# EAGLE design TheLittleEngineers.org-27C512E-TO-2532S-V1R1.20.APRIL.2019 (EAGLE 5.10)
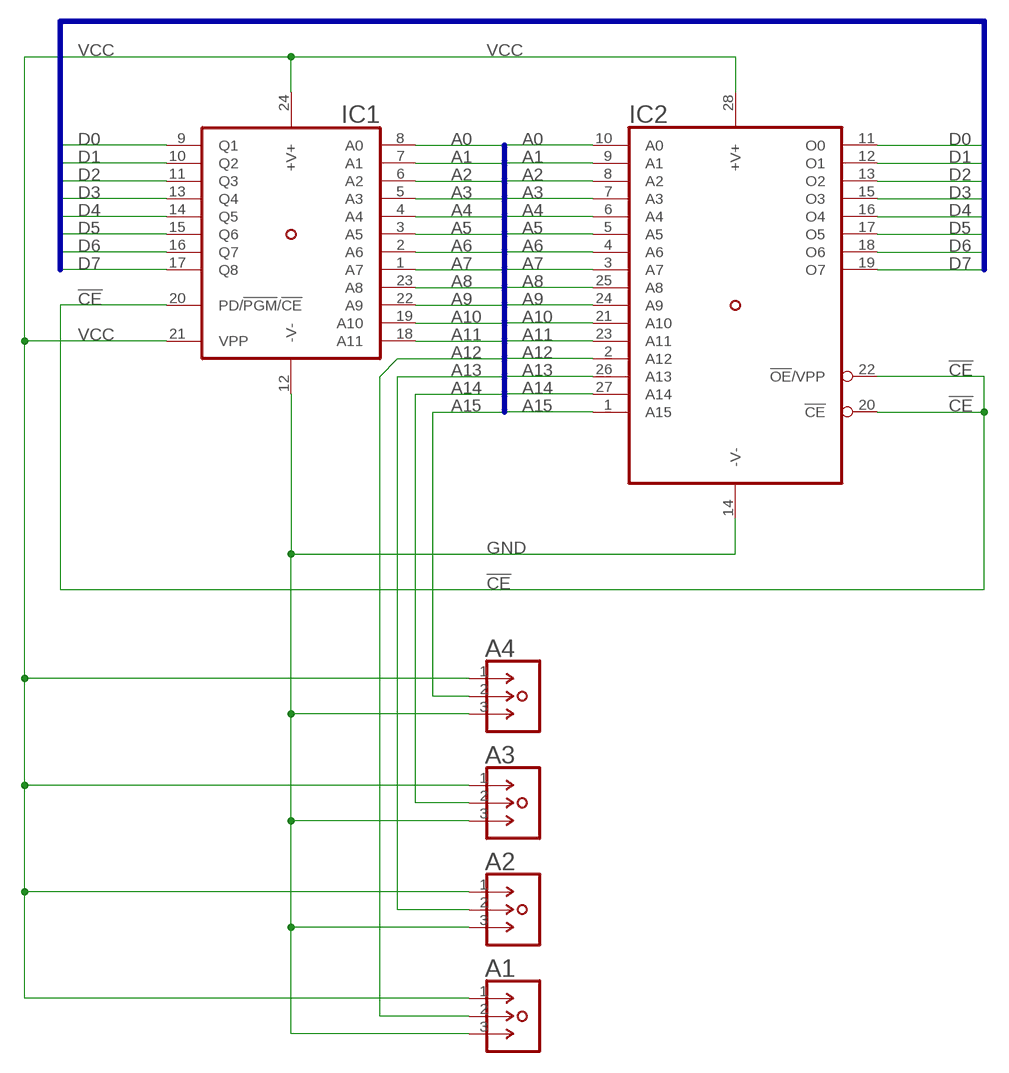
[diagram p0: schematic, sheet 1]

## Parts
A1  1X03-STAGGERED-S  [1X03-STAGGERED]
A2  1X03-STAGGERED-S  [1X03-STAGGERED]
A3  1X03-STAGGERED-S  [1X03-STAGGERED]
A4  1X03-STAGGERED-S  [1X03-STAGGERED]
IC1  TMS2532-NO  [DIL24-6-NO-OUTLINE]
IC2  27C512D-NO  [DIL28-6-NO-OUTLINE]

## Nets
!CE: IC1.20(PD/!PGM!/!CE) IC2.20(!CE) IC2.22(!OE!/VPP)
A0: IC1.8(A0) IC2.10(A0)
A1: IC1.7(A1) IC2.9(A1)
A2: IC1.6(A2) IC2.8(A2)
A3: IC1.5(A3) IC2.7(A3)
A4: IC1.4(A4) IC2.6(A4)
A5: IC1.3(A5) IC2.5(A5)
A6: IC1.2(A6) IC2.4(A6)
A7: IC1.1(A7) IC2.3(A7)
A8: IC1.23(A8) IC2.25(A8)
A9: IC1.22(A9) IC2.24(A9)
A10: IC1.19(A10) IC2.21(A10)
A11: IC1.18(A11) IC2.23(A11)
A12: A1.2 IC2.2(A12)
A13: A2.2 IC2.26(A13)
A14: A3.2 IC2.27(A14)
A15: A4.2 IC2.1(A15)
D0: IC1.9(Q1) IC2.11(O0)
D1: IC1.10(Q2) IC2.12(O1)
D2: IC1.11(Q3) IC2.13(O2)
D3: IC1.13(Q4) IC2.15(O3)
D4: IC1.14(Q5) IC2.16(O4)
D5: IC1.15(Q6) IC2.17(O5)
D6: IC1.16(Q7) IC2.18(O6)
D7: IC1.17(Q8) IC2.19(O7)
GND [power]: A1.3 A2.3 A3.3 A4.3 IC1.12(-V-) IC2.14(-V-)
VCC [power]: A1.1 A2.1 A3.1 A4.1 IC1.21(VPP) IC1.24(+V+) IC2.28(+V+)

## Buses
D[0..7]
A[0..15]

## Library data of the parts
A1-A4 = TheLittleEngineers.org-27C512E-TO-2532S-V1R0.20.APRIL.2019:1X03-STAGGERED: 3-Pin SIP Header Copyright ©07 Jan 2013, by: Robert "The R.A.T." Allen Turner http://www.TheLittleEngineers.org/ TheLittleEngineers@outlook.com OurLittleEngineers@gMail.com You may use these components in your own projects, however, please take note that we CANNOT guarantee the accuracy of these components (nor any part of this library). We make NO guarantees that the components, footprints or schematic symbols in this library are flawless, and we make no promises of fitness for production, prototyping or any other purpose. These libraries are provided for informational purposes only, and are used at your own discretion. By downloading these libraries, you agree that we cannot be held responsible for faulty PCBs. You should always check the footprints with a 1:1 printout. Neither Robert Allen Turner, The Little Engineers <http://www.TheLittleEngineers.org/>, TheLittleEngineers.org, GIMEchip.com, nor anyone affiliated with same shall be held responsible for any outcome resulting from the usage of these files. Should any errors be found, please contact us at one of the above email addresses and we will attempt to repair them. Unless otherwise noted, content of this library is licensed under a Creative Commons Attribution-ShareAlike 4.0 International (CC BY-SA 4.0) license (https://creativecommons.org/licenses/by-sa/4.0/) on 20 April 2019 in memory of my Father, Robert Embry Turner - I LOVE YOU DAD! Rest In Peace. Please note that the GIMEchip.com domain was acquired by Robert "The R.A.T." Allen Turner on December 24, 2018 from the prior owners, which happen to be his brother and nephew. As such, "The R.A.T." is unable to answer any inquiries regarding any products or services of GIMEchip.com prior to that date. "The R.A.T." also acquired the rights to all products previously produced by GIMEchip.com and its previous owners. Those products will all be released as open source, under a Creative Commons Attribution-ShareAlike 4.0 International (CC BY-SA 4.0) license (https://creativecommons.org/licenses/by-sa/4.0/), as time and resources permit.
IC1 = TheLittleEngineers.org-27C512E-TO-2532S-V1R0.20.APRIL.2019:TMS2532: TMS2532 Copyright ©07 Jan 2013, by: Robert "The R.A.T." Allen Turner http://www.TheLittleEngineers.org/ TheLittleEngineers@outlook.com OurLittleEngineers@gMail.com You may use these components in your own projects, however, please take note that we CANNOT guarantee the accuracy of these components (nor any part of this library). We make NO guarantees that the components, footprints or schematic symbols in this library are flawless, and we make no promises of fitness for production, prototyping or any other purpose. These libraries are provided for informational purposes only, and are used at your own discretion. By downloading these libraries, you agree that we cannot be held responsible for faulty PCBs. You should always check the footprints with a 1:1 printout. Neither Robert Allen Turner, The Little Engineers <http://www.TheLittleEngineers.org/>, TheLittleEngineers.org, GIMEchip.com, nor anyone affiliated with same shall be held responsible for any outcome resulting from the usage of these files. Should any errors be found, please contact us at one of the above email addresses and we will attempt to repair them. Unless otherwise noted, content of this library is licensed under a Creative Commons Attribution-ShareAlike 4.0 International (CC BY-SA 4.0) license (https://creativecommons.org/licenses/by-sa/4.0/) on 20 April 2019 in memory of my Father, Robert Embry Turner - I LOVE YOU DAD! Rest In Peace. Please note that the GIMEchip.com domain was acquired by Robert "The R.A.T." Allen Turner on December 24, 2018 from the prior owners, which happen to be his brother and nephew. As such, "The R.A.T." is unable to answer any inquiries regarding any products or services of GIMEchip.com prior to that date. "The R.A.T." also acquired the rights to all products previously produced by GIMEchip.com and its previous owners. Those products will all be released as open source, under a Creative Commons Attribution-ShareAlike 4.0 International (CC BY-SA 4.0) license (https://creativecommons.org/licenses/by-sa/4.0/), as time and resources permit.
IC2 = TheLittleEngineers.org-27C512E-TO-2532S-V1R0.20.APRIL.2019:27C512D: 27C512D Copyright ©07 Jan 2013, by: Robert "The R.A.T." Allen Turner http://www.TheLittleEngineers.org/ TheLittleEngineers@outlook.com OurLittleEngineers@gMail.com You may use these components in your own projects, however, please take note that we CANNOT guarantee the accuracy of these components (nor any part of this library). We make NO guarantees that the components, footprints or schematic symbols in this library are flawless, and we make no promises of fitness for production, prototyping or any other purpose. These libraries are provided for informational purposes only, and are used at your own discretion. By downloading these libraries, you agree that we cannot be held responsible for faulty PCBs. You should always check the footprints with a 1:1 printout. Neither Robert Allen Turner, The Little Engineers <http://www.TheLittleEngineers.org/>, TheLittleEngineers.org, GIMEchip.com, nor anyone affiliated with same shall be held responsible for any outcome resulting from the usage of these files. Should any errors be found, please contact us at one of the above email addresses and we will attempt to repair them. Unless otherwise noted, content of this library is licensed under a Creative Commons Attribution-ShareAlike 4.0 International (CC BY-SA 4.0) license (https://creativecommons.org/licenses/by-sa/4.0/) on 20 April 2019 in memory of my Father, Robert Embry Turner - I LOVE YOU DAD! Rest In Peace. Please note that the GIMEchip.com domain was acquired by Robert "The R.A.T." Allen Turner on December 24, 2018 from the prior owners, which happen to be his brother and nephew. As such, "The R.A.T." is unable to answer any inquiries regarding any products or services of GIMEchip.com prior to that date. "The R.A.T." also acquired the rights to all products previously produced by GIMEchip.com and its previous owners. Those products will all be released as open source, under a Creative Commons Attribution-ShareAlike 4.0 International (CC BY-SA 4.0) license (https://creativecommons.org/licenses/by-sa/4.0/), as time and resources permit.

## Net classes
0 default: width 0.203 mm, clearance 0.203 mm
1 power: width 0.381 mm, clearance 0.203 mm

## Board
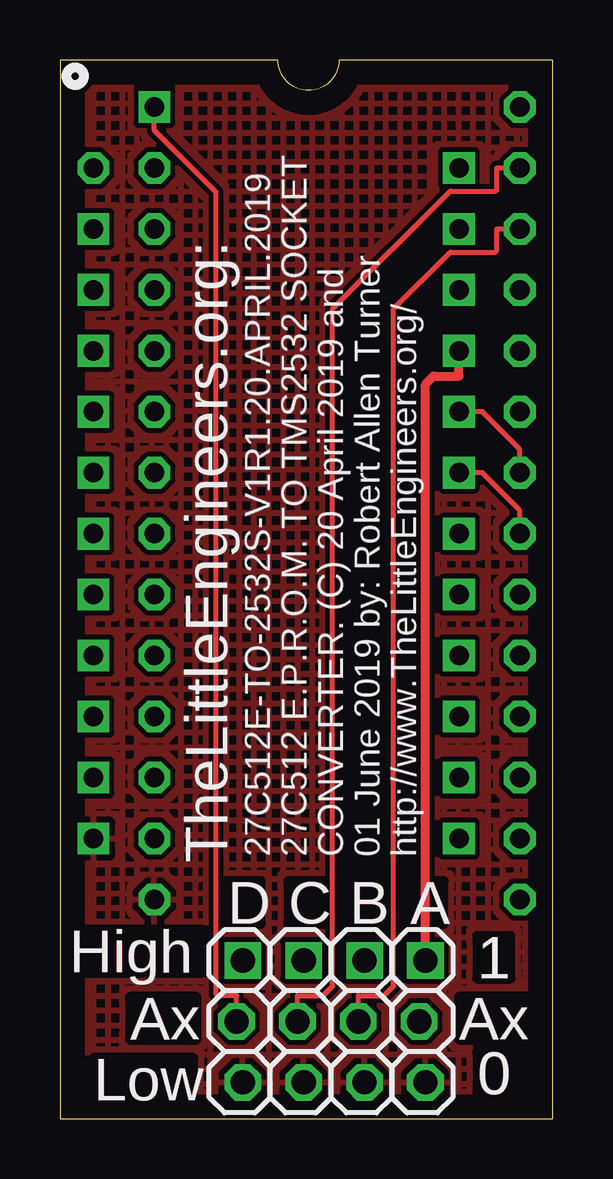
[diagram p1: board, top side]
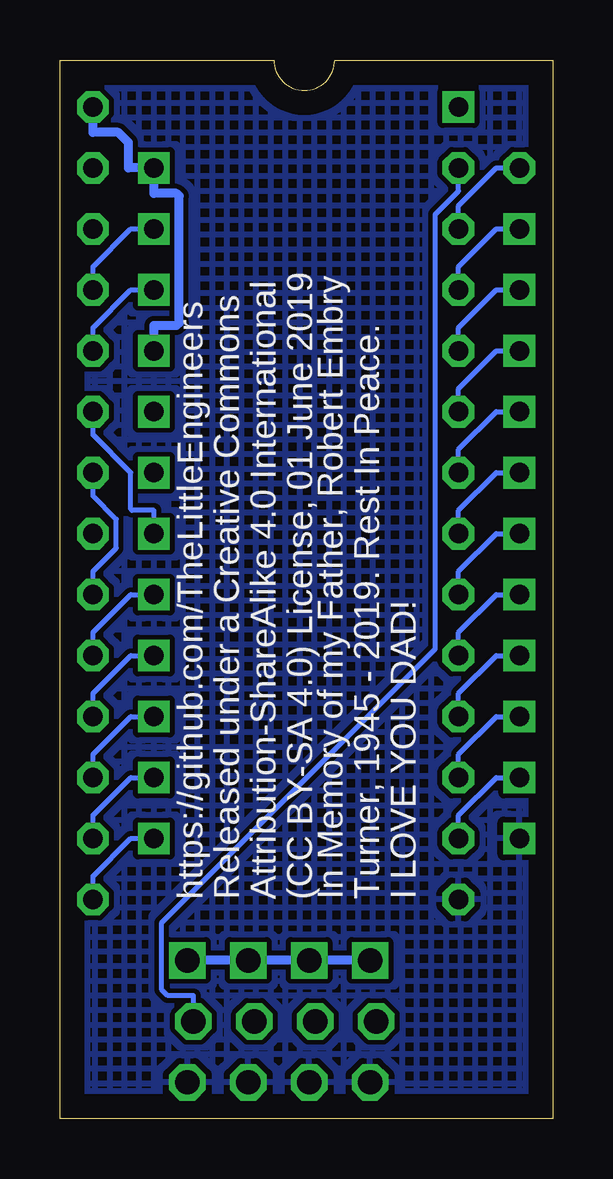
[diagram p2: board, bottom side, seen from below]

Size 20.55 x 44.12 mm. Coordinates in mm from the lower left corner, seen from the top.
Copper layers (1*16): Top 0.035mm / dielectric 1.5mm / Bottom 0.035mm
Design rules "default": minimum track width 10mil, minimum drill 24mil, track to track 8mil, track to pad 8mil, pad to pad 8mil, via to via 8mil, smd to smd 8mil, copper to edge 40mil, drill to drill 8mil, minimum pad ring 10mil, minimum via ring 8mil, stop-mask expansion 4mil, vias tented up to drill 0mil, thermal gap 10mil

### Footprints (pad centres in the part's own frame; a part is rotated, then mirrored left to right if it is on the bottom)
1X03-STAGGERED = drill 1.016 square: 1 -2.54,0.127 | drill 1.016 octagon: 2 0,-0.127; 3 2.54,0.127
DIL24-6-NO-OUTLINE = drill 0.813 octagon: 1 -13.97,-7.62 | drill 0.813 square: 2 -11.43,-7.62; 3 -8.89,-7.62; 4 -6.35,-7.62; 5 -3.81,-7.62; 6 -1.27,-7.62; 7 1.27,-7.62; 8 3.81,-7.62; 9 6.35,-7.62; 10 8.89,-7.62; 11 11.43,-7.62; 12 13.97,-7.62; 13 13.97,7.62; 14 11.43,7.62; 15 8.89,7.62; 16 6.35,7.62; 17 3.81,7.62; 18 1.27,7.62; 19 -1.27,7.62; 20 -3.81,7.62; 21 -6.35,7.62; 22 -8.89,7.62; 23 -11.43,7.62; 24 -13.97,7.62
DIL28-6-NO-OUTLINE = drill 0.813 square: 1 -16.51,-7.62 | drill 0.813 octagon: 2 -13.97,-7.62; 3 -11.43,-7.62; 4 -8.89,-7.62; 5 -6.35,-7.62; 6 -3.81,-7.62; 7 -1.27,-7.62; 8 1.27,-7.62; 9 3.81,-7.62; 10 6.35,-7.62; 11 8.89,-7.62; 12 11.43,-7.62; 13 13.97,-7.62; 14 16.51,-7.62; 15 16.51,7.62; 16 13.97,7.62; 17 11.43,7.62; 18 8.89,7.62; 19 6.35,7.62; 20 3.81,7.62; 21 1.27,7.62; 22 -1.27,7.62; 23 -3.81,7.62; 24 -6.35,7.62; 25 -8.89,7.62; 26 -11.43,7.62; 27 -13.97,7.62; 28 -16.51,7.62

### Placement (x,y rotation side)
A1  15.11,4.06 270 top
A2  12.57,4.06 270 top
A3  10.03,4.06 270 top
A4  7.49,4.06 270 top
IC1  9.02,25.65 270 top
IC2  11.56,25.65 270 top
U$1  [OUTLINE]  1.4,0.25 0 top

### Tracks (layer width: path | path; a pad name or v marks a point on that pad's centre or on a via)
!CE
  Top 0.203: IC1.20 17.6,29.46 19.18,27.89 IC2.22
  Bottom 0.203: IC2.22 19.18,25.96 18.21,24.99 18.21,23.78 19.18,22.81 IC2.20
A0
  Bottom 0.203: IC1.8 2.37,21.84 3.94,20.27 IC2.10
A1
  Bottom 0.203: IC1.7 2.37,24.38 3.94,22.81 IC2.9
A2
  Bottom 0.203: IC1.6 2.37,26.92 3.94,25.35 IC2.8
A3
  Bottom 0.203: IC1.5 2.37,29.46 3.94,27.89 IC2.7
A4
  Bottom 0.203: IC1.4 2.37,32 3.94,30.43 IC2.6
A5
  Bottom 0.203: IC1.3 2.37,34.54 3.94,32.97 IC2.5
A6
  Bottom 0.203: IC1.2 2.37,37.08 3.94,35.51 IC2.4
A7
  Bottom 0.203: IC1.1 2.37,39.62 3.94,38.05 IC2.3
A8
  Bottom 0.203: IC1.23 17.6,37.08 19.18,35.51 IC2.25
A9
  Bottom 0.203: IC1.22 17.6,34.54 19.18,32.97 IC2.24
A10
  Top 0.203: IC1.19 17.6,26.92 19.18,25.35 IC2.21
A11
  Bottom 0.203: IC1.18 16.64,25.35 17.55,25.35 17.6,25.41 17.6,26.92 19.18,28.5 IC2.23
A12
  Bottom 0.203: A1.2 14.99,5.13 16.05,5.13 16.31,5.39 16.31,8.17 4.91,19.58 4.91,37.69 3.94,38.66 IC2.2
A13
  Top 0.203: A2.2 12.45,5.13 13.52,5.13 13.91,5.53 13.91,33.75 16.28,36.12 18.15,36.12 18.21,36.17 18.21,37.08 IC2.26
A14
  Top 0.203: A3.2 9.91,5.13 10.97,5.13 11.37,5.53 11.37,33.75 16.28,38.66 18.15,38.66 18.21,38.71 18.21,39.62 IC2.27
A15
  Top 0.203: A4.2 7.37,5.13 6.58,5.13 6.52,5.19 6.52,38.61 3.94,41.2 IC2.1
D0
  Bottom 0.203: IC1.9 2.37,19.3 3.94,17.73 IC2.11
D1
  Bottom 0.203: IC1.10 2.37,16.76 3.94,15.19 IC2.12
D2
  Bottom 0.203: IC1.11 2.37,14.22 3.94,12.65 IC2.13
D3
  Bottom 0.203: IC1.13 17.6,11.68 19.18,10.11 IC2.15
D4
  Bottom 0.203: IC1.14 17.6,14.22 19.18,12.65 IC2.16
D5
  Bottom 0.203: IC1.15 17.6,16.76 19.18,15.19 IC2.17
D6
  Bottom 0.203: IC1.16 17.6,19.3 19.18,17.73 IC2.18
D7
  Bottom 0.203: IC1.17 17.6,21.84 19.18,20.27 IC2.19
GND
  pour Top (hatched): -0.13,44.2 20.7,44.2 20.7,0 -0.13,0
  pour Bottom (hatched): -0.13,44.2 20.7,44.2 20.7,0 -0.13,0
VCC
  Top 0.381: IC1.21 16.64,30.95 15.58,30.95 15.24,30.61 A1.1
  Bottom 0.381: IC2.28 19.18,41.11 18.12,41.11 17.69,40.68 17.69,39.62 IC1.24 16.64,38.57 15.69,38.57 15.58,38.46 15.58,33.17 15.69,33.06 16.64,33.06 IC1.21 | A1.1 A2.1 A3.1 A4.1
(copper drawn outside any net)
  shapes: Top circle x1

### Text on the board
Top: D | C | B | A | High | 1 | Ax | Ax | Low | 0
tPlace: 27C512E-TO-2532S-V1R1.20.APRIL.2019 | 27C512 E.P.R.O.M. TO TMS2532 SOCKET | CONVERTER. (C) 20 April 2019 and | 01 June 2019 by: Robert Allen Turner | http://www.TheLittleEngineers.org/ | TheLittleEngineers.org: | D | C | B | A | High | 1 | Ax | Ax | Low | 0
bPlace: I LOVE YOU DAD! | Turner, 1945 - 2019. Rest In Peace. | In Memory of my Father, Robert Embry | (CC BY-SA 4.0) License, 01 June 2019 | Attribution-ShareAlike 4.0 International | Released under a Creative Commons | https://github.com/TheLittleEngineers